# Altium schematic sheet Sheet1.SchDoc
size A4; SheetNumber: 1; SheetTotal: 1; SPICEModelCacheXCBYASZT: <root> / <DocumentId>XCBYASZT</DocumentId> / <CacheFrame Number="0"> / <Model Name="xtal" Kind="CKT"> / <Text>*Generic type:crystal pkg:HC33/51 / .SUBCKT XTAL 1 2 PARAMS: FREQ=1Meg RS=750 C=13pf Q=1000 / LX 1 3 {((Q*RS)/(6.2831852*FREQ))} IC=0.5M / CX 3 4 {(1/(Q*6.2831852*FREQ*RS))} / C0 1 2 {C} / RS 4 2 {RS} / .ENDS XTAL</Text> / </Model> / </CacheFrame> / </root>
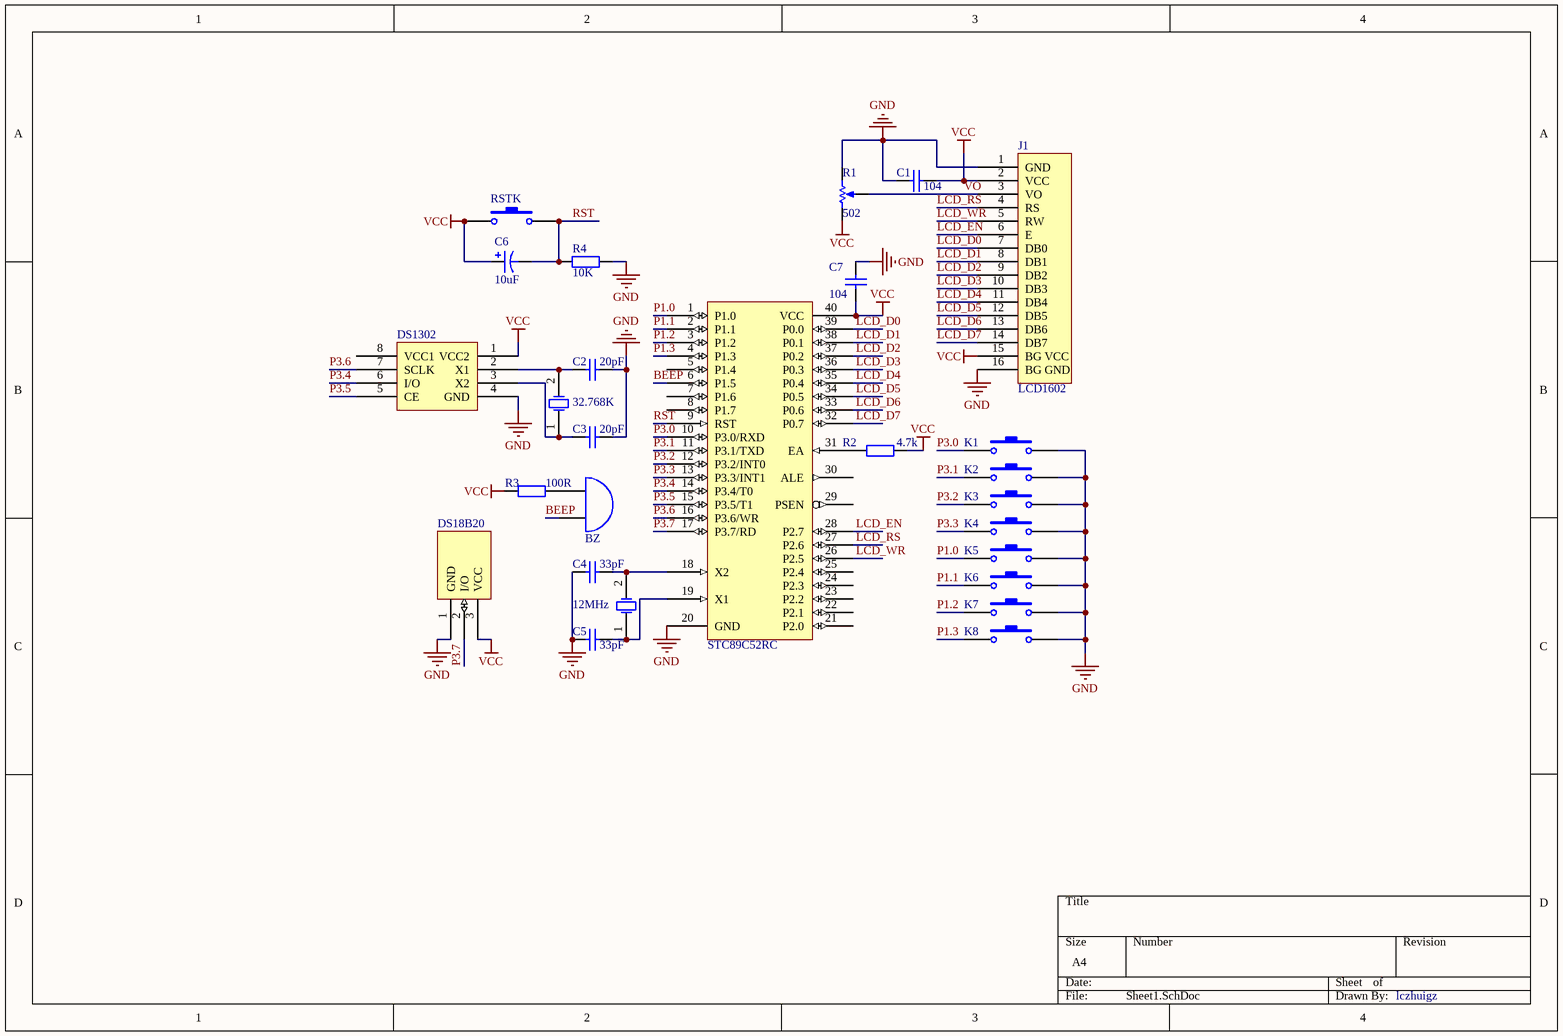
[diagram p0: Sheet1.SchDoc]

## Parts
*  DS18B20
BZ  BZ  [PIN2]
C1  value 104  [RAD-0.3]  (hidden comment: Cap)
C2  value 20pF  [RAD-0.3]  (hidden comment: Cap)
C3  value 20pF  [RAD-0.3]  (hidden comment: Cap)
C4  value 33pF  [RAD-0.3]  (hidden comment: Cap)
C5  value 33pF  [RAD-0.3]  (hidden comment: Cap)
C6  value 10uF  [RB7.6-15]  (hidden comment: Cap Pol1)
C7  value 104  [RAD-0.3]  (hidden comment: Cap)
J1  LCD1602
K1  SW-PB  [SPST-2]  (value not drawn)
K2  SW-PB  [SPST-2]  (value not drawn)
K3  SW-PB  [SPST-2]  (value not drawn)
K4  SW-PB  [SPST-2]  (value not drawn)
K5  SW-PB  [SPST-2]  (value not drawn)
K6  SW-PB  [SPST-2]  (value not drawn)
K7  SW-PB  [SPST-2]  (value not drawn)
K8  SW-PB  [SPST-2]  (value not drawn)
R1  value 502  [VR5]  (hidden comment: RPot)
R2  value 4.7k  [AXIAL-0.4]  (hidden comment: Res2)
R3  value 100R  [AXIAL-0.4]  (hidden comment: Res2)
R4  value 10K  [AXIAL-0.4]  (hidden comment: Res2)
RSTK  SW-PB  [SPST-2]  (value not drawn)
STC89C52RC  STC89C52RC  [DIP40 - duplicate]
U?  DS1302
Y12  32.768K  [R38]
Y?  12MHz  [R38]

## Nets
GND: *.1(GND) C1.1 C2.2 C3.2 C4.1 C5.1 C7.2 J1.1(GND) J1.16(BG_GND) K1.2 K2.2 K3.2 K4.2 K5.2 K6.2 K7.2 K8.2 R1.2(BOT) R4.2 STC89C52RC.20(GND) U?.4(GND)
VCC: *.3(VCC) C1.2 C6.1 C7.1 J1.2(VCC) J1.15(BG_VCC) R1.1(TOP) R2.2 R3.1 RSTK.1 STC89C52RC.40(VCC) U?.1(VCC2)
BEEP: BZ.2(B) STC89C52RC.6(P1.5)
LCD_D0: J1.7(DB0) STC89C52RC.39(P0.0)
LCD_D1: J1.8(DB1) STC89C52RC.38(P0.1)
LCD_D2: J1.9(DB2) STC89C52RC.37(P0.2)
LCD_D3: J1.10(DB3) STC89C52RC.36(P0.3)
LCD_D4: J1.11(DB4) STC89C52RC.35(P0.4)
LCD_D5: J1.12(DB5) STC89C52RC.34(P0.5)
LCD_D6: J1.13(DB6) STC89C52RC.33(P0.6)
LCD_D7: J1.14(DB7) STC89C52RC.32(P0.7)
LCD_EN: J1.6(E) STC89C52RC.28(P2.7)
LCD_RS: J1.4(RS) STC89C52RC.27(P2.6)
LCD_WR: J1.5(RW) STC89C52RC.26(P2.5)
P1.0: K5.1 STC89C52RC.1(P1.0)
P1.1: K6.1 STC89C52RC.2(P1.1)
P1.2: K7.1 STC89C52RC.3(P1.2)
P1.3: K8.1 STC89C52RC.4(P1.3)
P3.0: K1.1 STC89C52RC.10(P3.0/RXD)
P3.1: K2.1 STC89C52RC.11(P3.1/TXD)
P3.2: K3.1 STC89C52RC.12(P3.2/INT0)
P3.3: K4.1 STC89C52RC.13(P3.3/INT1)
P3.4: STC89C52RC.14(P3.4/T0) U?.6(I/O)
P3.5: STC89C52RC.15(P3.5/T1) U?.5(CE)
P3.6: STC89C52RC.16(P3.6/WR) U?.7(SCLK)
P3.7: *.2(I/O) STC89C52RC.17(P3.7/RD)
RST: C6.2 R4.1 RSTK.2 STC89C52RC.9(RST)
VO: J1.3(VO) R1.3(TAP)
NetBZ_1: BZ.1(A) R3.2
NetC2_1: C2.1 U?.2(X1) Y12.2(OSC2)
NetC3_1: C3.1 U?.3(X2) Y12.1(OSC1)
NetC4_2: C4.2 STC89C52RC.18(X2) Y?.2(OSC2)
NetC5_2: C5.2 STC89C52RC.19(X1) Y?.1(OSC1)
NetR2_1: R2.1 STC89C52RC.31(EA)

Not connected (* = marked no-connect by the designer): STC89C52RC 5(P1.4) 7(P1.6) 8(P1.7) 21(P2.0) 22(P2.1) 23(P2.2) 24(P2.3) 25(P2.4) 29(PSEN) 30(ALE); U? 8(VCC1)

## Notes on the sheet
- lczhuigz

## Library data of the parts
BZ = Bell: Electrical Bell; Published: 24-Mar-1999; LatestRevisionDate: 17-Jul-2002; LatestRevisionNote: Re-released for DXP Platform.; PackageReference: PIN2; Publisher: Altium Limited
C1-C5 C7 = Cap: Capacitor; Published: 8-Jun-2000; LatestRevisionDate: 17-Jul-2002; LatestRevisionNote: Re-released for DXP Platform.; PackageReference: RAD-0.3; Publisher: Altium Limited; PackageDescription: Radial Cap, Thru-Hole; 2 Leads; 0.3 in Pin Spacing
C6 = Cap Pol1: Polarized Capacitor (Radial); Published: 8-Jun-2000; LatestRevisionDate: 17-Jul-2002; LatestRevisionNote: Re-released for DXP Platform.; PackageReference: RB7.6-15; Publisher: Altium Limited; PackageDescription: Polarized Capacitor (Radial); 2 Leads
K1-K8 RSTK = SW-PB: Switch; Published: 24-Mar-1999; LatestRevisionDate: 17-Jul-2002; LatestRevisionNote: Re-released for DXP Platform.; PackageReference: SPST-2; Publisher: Altium Limited; PackageDescription: Switch; 2 Leads
R1 = RPot: Potentiometer; Sim Note: Enter the Resistance value and the set point into parameter fields.; Set Position: 0.5; Published: 8-Jun-2000; LatestRevisionDate: 17-Jul-2002; LatestRevisionNote: Re-released for DXP Platform.; PackageReference: VR5; Publisher: Altium Limited; PackageDescription: Variable Resistor, Thru-Hole; 3 Leads
R2-R4 = Res2: Resistor; Published: 8-Jun-2000; LatestRevisionDate: 17-Jul-2002; LatestRevisionNote: Re-released for DXP Platform.; PackageReference: AXIAL-0.4; Publisher: Altium Limited; PackageDescription: Axial Device, Thru-Hole; 2 Leads; 0.4 in Pin Spacing
Y12 Y? = XTAL: Crystal Oscillator; Published: 8-Jun-2000; LatestRevisionDate: 17-Jul-2002; LatestRevisionNote: Re-released for DXP Platform.; PackageReference: R38; Publisher: Altium Limited; PackageDescription: Crystal, Thru-Hole; 2 Leads; Body 3.1 x 8.2 mm (Dia.xH)